# Altium project EM78P510_EM78M611_EM198810.PrjPCB
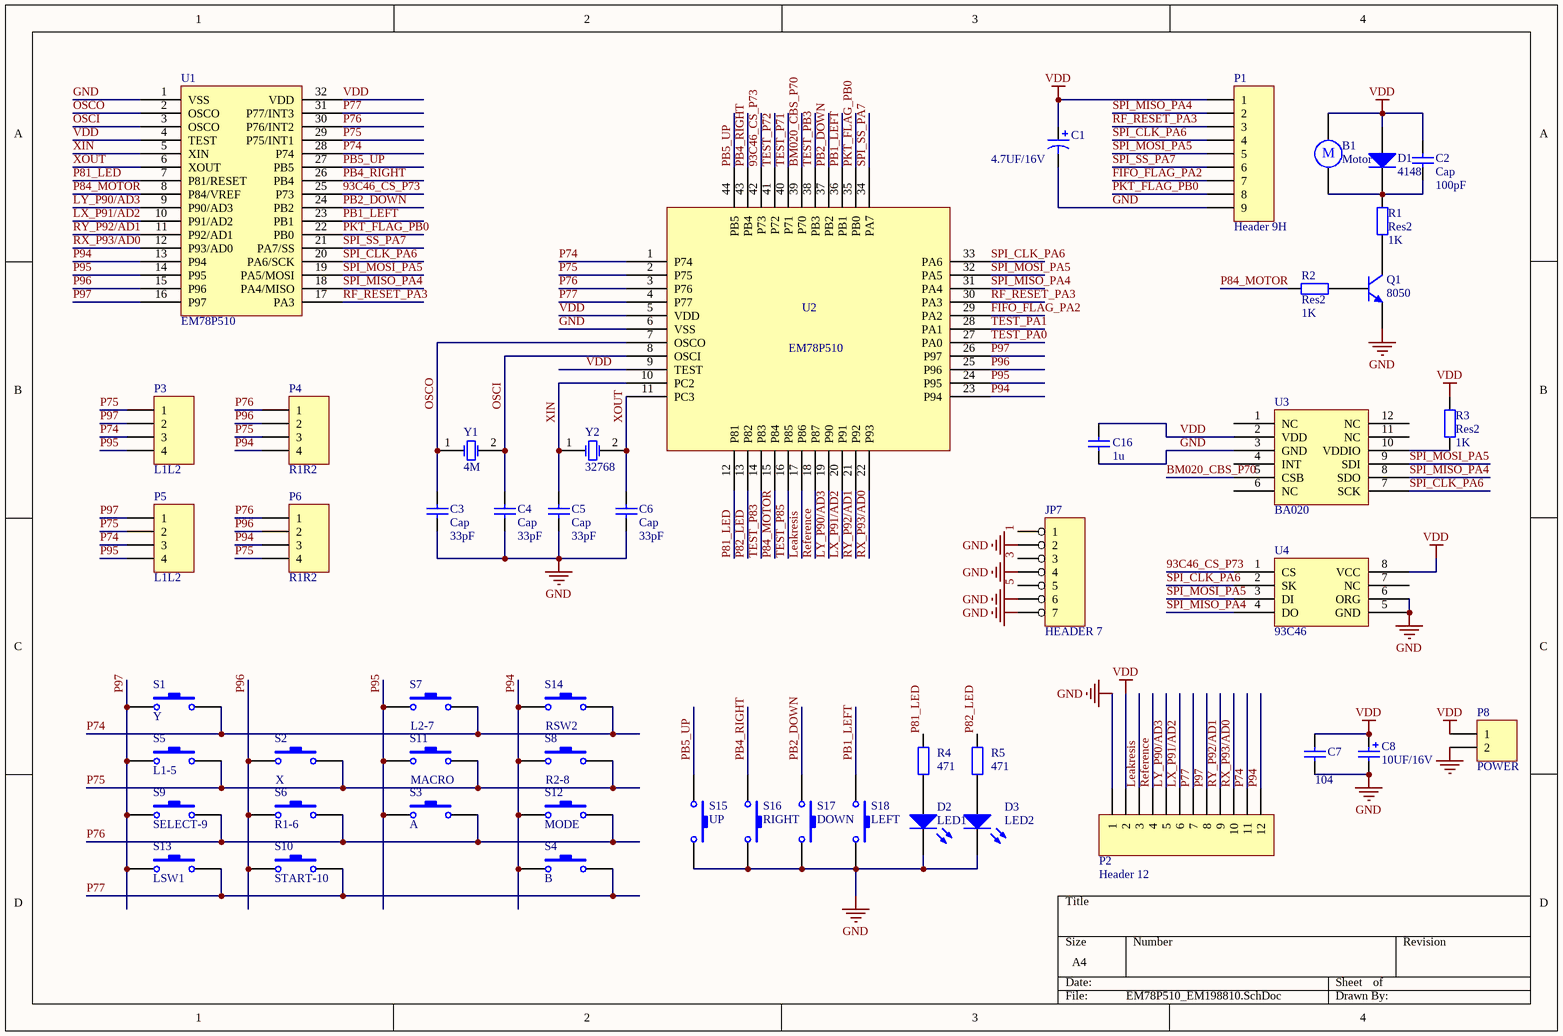
[diagram p0: EM78P510_EM198810.SchDoc]
2 sheets, 66 parts. Net scope: global (net labels, ports and power ports of the same name join across sheets).
Board file: Game Joystick 510.PcbDoc
Sheets:
  EM78P510_EM198810.SchDoc
  EM78M611RX.SchDoc

## Sheet EM78P510_EM198810.SchDoc
size A4

### Parts
B1  Motor  [sip2]
C1  value 4.7UF/16V  [c1206-2]  (hidden comment: Cap Pol1)
C2  Cap  value 100pF  [c0805]
C3  Cap  value 33pF  [c0805]
C4  Cap  value 33pF  [c0805]
C5  Cap  value 33pF  [c0805]
C6  Cap  value 33pF  [c0805]
C7  value 104  [C0805]  (hidden comment: Cap)
C8  value 10UF/16V  [RB5]  (hidden comment: Cap Pol1)
C16  value 1u  [C0805]  (hidden comment: Cap)
D1  4148  [d1407]
D2  LED1  [led-3]
D3  LED2  [led-3]
JP7  HEADER 7  [CON5]
P1  Header 9H  [rfm]
P2  Header 12  [SIP12]
P3  L1L2  [SIP4]
P4  R1R2  [SIP4]
P5  L1L2  [SIP4]
P6  R1R2  [SIP4]
P8  POWER  [SIP2]
Q1  8050  [sot-23]
R1  Res2  value 1K  [r0805]
R2  Res2  value 1K  [r0805]
R3  Res2  value 1K  [r0805]
R4  value 471  [r0805]  (hidden comment: Res2)
R5  value 471  [r0805]  (hidden comment: Res2)
S1  Y  [KeyPad1]
S2  X  [KeyPad1]
S3  A  [KeyPad1]
S4  B  [KeyPad1]
S5  L1-5  [KeyPad1]
S6  R1-6  [KeyPad1]
S7  L2-7  [KeyPad1]
S8  R2-8  [KeyPad1]
S9  SELECT-9  [KeyPad2]
S10  START-10  [KeyPad2]
S11  MACRO  [KeyPad2]
S12  MODE  [KeyPad2]
S13  LSW1  [KeyPad1]
S14  RSW2  [KeyPad1]
S15  UP  [KeyPad1]
S16  RIGHT  [KeyPad1]
S17  DOWN  [KeyPad1]
S18  LEFT  [KeyPad1]
U1  EM78P510
U2  EM78P510
U3  BA020  [lcc12]
U4  93C46  [sop8]
Y1  4M  [XTAL1]
Y2  32768  [XTAL2]

### Nets
GND: C1.2 C3.1 C4.1 C5.1 C6.1 C7.1 C8.2 C16.1 D2.2(K) D3.2(K) JP7.2 JP7.4 JP7.6 JP7.7 P1.9 P2.1 P8.2 Q1.3(E) S15.2 S16.2 S17.2 S18.2 U1.1(VSS) U2.6(VSS) U3.3(GND) U4.5(GND) U4.6(ORG)
VDD: B1.1 C1.1 C2.2 C7.2 C8.1 C16.2 D1.1(A) P1.1 P2.2 P8.1 R3.1 U1.4(TEST) U1.32(VDD) U2.5(VDD) U2.9(TEST) U3.2(VDD) U4.8(VCC)
1: JP7.1
3: JP7.3
5: JP7.5
93C46_CS_P73: U1.25(P73) U2.42(P73) U4.1(CS)
BM020_CBS_P70: U2.39(P70) U3.5(CSB)
FIFO_FLAG_PA2: P1.7 U2.29(PA2)
Leakresis: P2.3 U2.17(P86)
LX_P91/AD2: P2.6 U1.10(P91/AD2) U2.20(P91)
LY_P90/AD3: P2.5 U1.9(P90/AD3) U2.19(P90)
OSCI: C4.2 U1.3(OSCO) U2.8(OSCI) Y1.2(OSC2)
OSCO: C3.2 U1.2(OSCO) U2.7(OSCO) Y1.1(OSC1)
P74: P2.11 P3.3 P5.3 S1.2 S7.2 S14.2 U1.28(P74) U2.1(P74)
P75: P3.1 P4.3 P5.2 P6.4 S2.2 S5.2 S8.2 S11.2 U1.29(P75/INT1) U2.2(P75)
P76: P4.1 P6.1 S3.2 S6.2 S9.2 S12.2 U1.30(P76/INT2) U2.3(P76)
P77: P2.7 S4.2 S10.2 S13.2 U1.31(P77/INT3) U2.4(P77)
P81_LED: R4.1 U1.7(P81/RESET) U2.12(P81)
P82_LED: R5.1 U2.13(P82)
P84_MOTOR: R2.1 U1.8(P84/VREF) U2.15(P84)
P94: P2.12 P4.4 P6.3 S4.1 S8.1 S12.1 S14.1 U1.13(P94) U2.23(P94)
P95: P3.4 P5.4 S3.1 S7.1 S11.1 U1.14(P95) U2.24(P95)
P96: P4.2 P6.2 S2.1 S6.1 S10.1 U1.15(P96) U2.25(P96)
P97: P2.8 P3.2 P5.1 S1.1 S5.1 S9.1 S13.1 U1.16(P97) U2.26(P97)
PB1_LEFT: S18.1 U1.23(PB1) U2.36(PB1)
PB2_DOWN: S17.1 U1.24(PB2) U2.37(PB2)
PB4_RIGHT: S16.1 U1.26(PB4) U2.43(PB4)
PB5_UP: S15.1 U1.27(PB5) U2.44(PB5)
PKT_FLAG_PB0: P1.8 U1.22(PB0) U2.35(PB0)
Reference: P2.4 U2.18(P87)
RF_RESET_PA3: P1.3 U1.17(PA3) U2.30(PA3)
RX_P93/AD0: P2.10 U1.12(P93/AD0) U2.22(P93)
RY_P92/AD1: P2.9 U1.11(P92/AD1) U2.21(P92)
SPI_CLK_PA6: P1.4 U1.20(PA6/SCK) U2.33(PA6) U3.7(SCK) U4.2(SK)
SPI_MISO_PA4: P1.2 U1.18(PA4/MISO) U2.31(PA4) U3.8(SDO) U4.4(DO)
SPI_MOSI_PA5: P1.5 U1.19(PA5/MOSI) U2.32(PA5) U3.9(SDI) U4.3(DI)
SPI_SS_PA7: P1.6 U1.21(PA7/SS) U2.34(PA7)
TEST_P71: U2.40(P71)
TEST_P72: U2.41(P72)
TEST_P83: U2.14(P83)
TEST_P85: U2.16(P85)
TEST_PA0: U2.27(PA0)
TEST_PA1: U2.28(PA1)
TEST_PB3: U2.38(PB3)
XIN: C5.2 U1.5(XIN) U2.10(PC2) Y2.1(OSC1)
XOUT: C6.2 U1.6(XOUT) U2.11(PC3) Y2.2(OSC2)
NetB1_2: B1.2 C2.1 D1.2(K) R1.1
NetD2_1: D2.1(A) R4.2
NetD3_1: D3.1(A) R5.2
NetQ1_1: Q1.1(C) R1.2
NetQ1_2: Q1.2(B) R2.2
NetR3_2: R3.2 U3.10(VDDIO)

Not connected (* = marked no-connect by the designer): U3 1(NC) 4(INT) 6(NC) 11(NC) 12(NC); U4 7(NC)

### Notes on the sheet
- (in symbol Motor) M

### Library data of the parts
B1 = Motor: Motor, General Kind; Published: 24-Mar-1999; LatestRevisionDate: 17-Jul-2002; LatestRevisionNote: Re-released for DXP Platform.; PackageReference: RB5-10.5; Publisher: Altium Limited
C1 C8 = Cap Pol1: Polarized Capacitor (Radial); Published: 8-Jun-2000; LatestRevisionDate: 17-Jul-2002; LatestRevisionNote: Re-released for DXP Platform.; PackageReference: RB7.6-15; Publisher: Altium Limited
C2-C7 C16 = Cap: Capacitor; Published: 8-Jun-2000; LatestRevisionDate: 17-Jul-2002; LatestRevisionNote: Re-released for DXP Platform.; PackageReference: RAD-0.3; Publisher: Altium Limited
D1 = Diode: Default Diode; Published: 8-Jun-2000; LatestRevisionDate: 17-Jul-2002; LatestRevisionNote: Re-released for DXP Platform.; PackageDocument: Sep-1996; PackageReference: SMC; Publisher: Altium Limited; Code_JEDEC: DO-214-AB
D2 D3 = LED0: Typical INFRARED GaAs LED; Published: 8-Jun-2000; LatestRevisionDate: 08-Jul-2005; LatestRevisionNote: Mech Layer 1 removed.; PackageReference: LED-0; Publisher: Altium Limited
P1 = Header 9H: Header, 9-Pin, Right Angle; LatestRevisionDate: 17-Jul-2002; LatestRevisionNote: Re-released for DXP Platform.; Publisher: Altium Limited
P2 = Header 12: Header, 12-Pin; LatestRevisionDate: 17-Jul-2002; LatestRevisionNote: Re-released for DXP Platform.; Publisher: Altium Limited
P3-P6 = Header 4: Header, 4-Pin; LatestRevisionDate: 17-Jul-2002; LatestRevisionNote: Re-released for DXP Platform.; Publisher: Altium Limited
P8 = Header 2: Header, 2-Pin; LatestRevisionDate: 17-Jul-2002; LatestRevisionNote: Re-released for DXP Platform.; Publisher: Altium Limited
Q1 = NPN: NPN Bipolar Transistor; Published: 8-Jun-2000; LatestRevisionDate: 17-Jul-2002; LatestRevisionNote: Re-released for DXP Platform.; PackageReference: TO-226; Publisher: Altium Limited; Code_JEDEC: TO-226-AA
R1-R5 = Res2: Resistor; Published: 8-Jun-2000; LatestRevisionDate: 17-Jul-2002; LatestRevisionNote: Re-released for DXP Platform.; PackageReference: AXIAL-0.4; Publisher: Altium Limited
S1-S18 = SW-PB: Switch; Published: 24-Mar-1999; LatestRevisionDate: 17-Jul-2002; LatestRevisionNote: Re-released for DXP Platform.; PackageReference: SPST-2; Publisher: Altium Limited
U1 = EM78P510-32
U2 = EM78P510-44
Y1 Y2 = XTAL: Crystal Oscillator; Published: 8-Jun-2000; LatestRevisionDate: 17-Jul-2002; LatestRevisionNote: Re-released for DXP Platform.; PackageReference: R38; Publisher: Altium Limited

## Sheet EM78M611RX.SchDoc
size A4
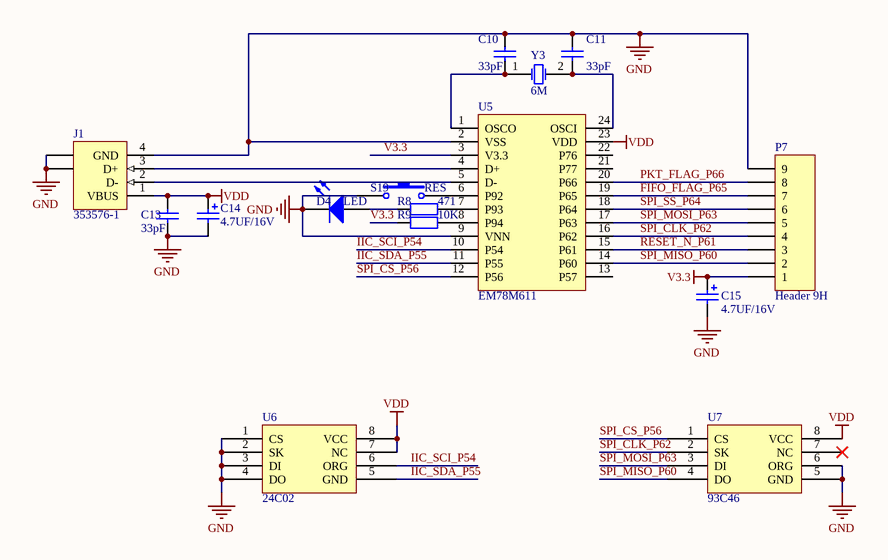
[diagram p1: EM78M611RX.SchDoc]

### Parts
C10  value 33pF  [c0805]  (hidden comment: Cap)
C11  value 33pF  [c0805]  (hidden comment: Cap)
C13  value 33pF  [c0805]  (hidden comment: Cap)
C14  value 4.7UF/16V  [C1206-2]  (hidden comment: Cap Pol1)
C15  value 4.7UF/16V  [RB5]  (hidden comment: Cap Pol1)
D4  LED  [led-3]
J1  353576-1  [USBSD]
P7  Header 9H  [rfm]
R8  value 471  [R0805]  (hidden comment: Res2)
R9  value 10K  [R0805]  (hidden comment: Res2)
S19  RES  [SW-PB]
U5  EM78M611  [DIP24]
U6  24C02  [sop8]
U7  93C46  [sop8]
Y3  6M  [CRY]

### Nets
GND: C10.1 C11.2 C13.1 C14.2 C15.2 D4.2(K) J1.4(GND) J1.5(SHLD) J1.6(SHLD) P7.9 S19.1 U5.2(VSS) U5.9(VNN) U6.1(CS) U6.2(SK) U6.3(DI) U6.4(DO) U7.5(GND) U7.6(ORG)
V3.3: C15.1 P7.1 R9.1 U5.3(V3.3)
VDD: C13.2 C14.1 J1.1(VBUS) U5.23(VDD) U6.7(NC) U6.8(VCC) U7.8(VCC)
FIFO_FLAG_P65: P7.7 U5.19(P65)
IIC_SCI_P54: U5.10(P54) U6.6(ORG)
IIC_SDA_P55: U5.11(P55) U6.5(GND)
PKT_FLAG_P66: P7.8 U5.20(P66)
RESET_N_P61: P7.3 U5.15(P61)
SPI_CLK_P62: P7.4 U5.16(P62) U7.2(SK)
SPI_CS_P56: U5.12(P56) U7.1(CS)
SPI_MISO_P60: P7.2 U5.14(P60) U7.4(DO)
SPI_MOSI_P63: P7.5 U5.17(P63) U7.3(DI)
SPI_SS_P64: P7.6 U5.18(P64)
NetC10_2: C10.2 U5.1(OSCO) Y3.1(OSC1)
NetC11_1: C11.1 U5.24(OSCI) Y3.2(OSC2)
NetD4_1: D4.1(A) R8.1
NetJ1_2: J1.2(D-) U5.5(D-)
NetJ1_3: J1.3(D+) U5.4(D+)
NetR8_2: R8.2 U5.7(P93)
NetR9_2: R9.2 U5.8(P94)
NetS19_2: S19.2 U5.6(P92)

Not connected (* = marked no-connect by the designer): U5 13(P57) 21(P77) 22(P76); U7 7(NC)*

### Library data of the parts
C10 C11 C13 = Cap: Capacitor; Published: 8-Jun-2000; LatestRevisionDate: 17-Jul-2002; LatestRevisionNote: Re-released for DXP Platform.; PackageReference: RAD-0.3; Publisher: Altium Limited
C14 C15 = Cap Pol1: Polarized Capacitor (Radial); Published: 8-Jun-2000; LatestRevisionDate: 17-Jul-2002; LatestRevisionNote: Re-released for DXP Platform.; PackageReference: RB7.6-15; Publisher: Altium Limited
D4 = LED0: Typical INFRARED GaAs LED; Published: 8-Jun-2000; LatestRevisionDate: 08-Jul-2005; LatestRevisionNote: Mech Layer 1 removed.; PackageReference: LED-0; Publisher: Altium Limited
J1 = 353576-1: USB 1.1, Right Angle, SMT, A Type, Receptacle, 4 Position, White; ContactMaterial: Copper Alloy; ContactPlating: Gold over Palladium Nickel; PCB_Layout: Complies with manufacturer's recommendation.; DrillSize: Corresponds to nominal value.; PanelGround: Without; Published: 15-Jul-2004; DatasheetDocument: 11-Apr-2003; PackageDocument: 11-Apr-2003; PackageReference: 353576; Publisher: Altium Limited; HousingMaterial: Thermoplastic; ComponentLink1Description: Manufacturer Link; ComponentLink1URL: http://www.tycoelectronics.com/; ComponentLink2Description: Packaging Specification; ComponentLink2URL: http://ecommas.tycoelectronics.com/commerce/DocumentDelivery/DDEController?Action=showdoc&DocId=Customer+Drawing%7F353576%7FD%7Ftif%7FJapanese%7FJPN_CD_353576_D.tif
P7 = Header 9H: Header, 9-Pin, Right Angle; LatestRevisionDate: 17-Jul-2002; LatestRevisionNote: Re-released for DXP Platform.; Publisher: Altium Limited
R8 R9 = Res2: Resistor; Published: 8-Jun-2000; LatestRevisionDate: 17-Jul-2002; LatestRevisionNote: Re-released for DXP Platform.; PackageReference: AXIAL-0.4; Publisher: Altium Limited
S19 = SW-PB: Switch; Published: 24-Mar-1999; LatestRevisionDate: 17-Jul-2002; LatestRevisionNote: Re-released for DXP Platform.; PackageReference: SPST-2; Publisher: Altium Limited
U5 = EM78M611-24
Y3 = XTAL: Crystal Oscillator; Published: 8-Jun-2000; LatestRevisionDate: 17-Jul-2002; LatestRevisionNote: Re-released for DXP Platform.; PackageReference: R38; Publisher: Altium Limited

## Nets that join several sheets
GND: EM78P510_EM198810 (27 pins), EM78M611RX (19 pins)
VDD: EM78P510_EM198810 (17 pins), EM78M611RX (7 pins)